# Altium schematic sheet Sensor.SCHDOC
size A4
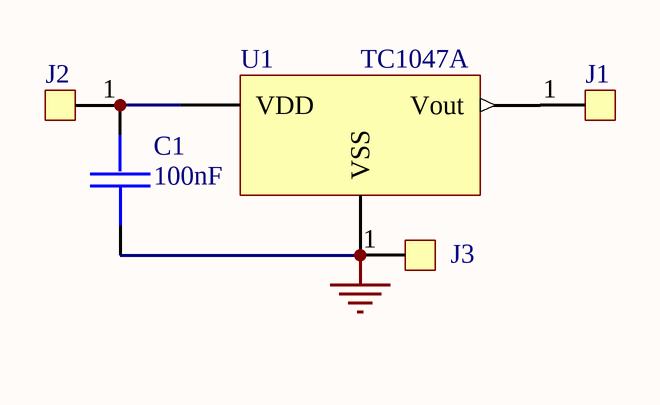
[diagram p0: Sensor.SCHDOC]

## Parts
C1  100nF  [0805]
J1  CON3  [CON2]  (value not drawn)
J2  CON3  [CON2]  (value not drawn)
J3  CON3  [CON2]  (value not drawn)
U1  TC1047A  [SOT-23]

## Nets
GND: C1.2 J3.1 U1.3(VSS)
NetC1_1: C1.1 J2.1 U1.1(VDD)
NetJ1_1: J1.1 U1.2(Vout)

## Notes on the sheet
- REV 1.00 IMPLEMENTACION
- Dib.
- A4
- Iniciales
- Firma
- Plano:
- Revisión:
- Rev.
- Código:
- Rev:
- Hoja          de
- PCB:
- RESISTORES DE 0 A 999 OHMS EN OHMS
  RESISTORES DE 1 A 999 KILOHMS EN K
  RESISTORES DE 1 A 999 MEGOHMS EN M
  CAPACITORES 0 A 999 pF EN pF
  CAPACITORES 1 A 999 nF EN nF
  CAPACITORES 1 A 99999 uF EN uF
  INDUCTORES 0 A 999 nH EN nH
  INDUCTORES 1 A 999 uH EN uH
  INDUCTORES 1 A 999 mH EN mH
- Apr.
- Archivo:

## Library data of the parts
C1 = 100n: CAPACITOR SMD 0805 X7R  50 V 100 nF; CODIGO: YSBC104AAG
J1-J3 = CON3: PAD 2X2
U1 = TC1047A: TC1047A SENSOR DE TEMPERATURA